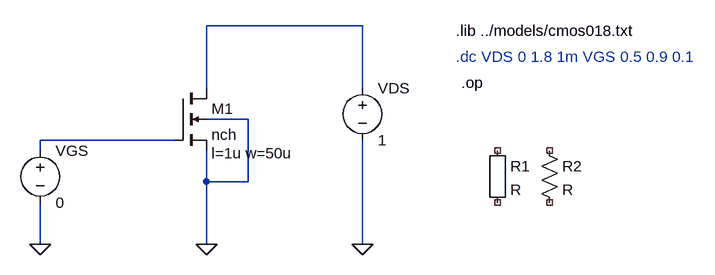
[diagram p0: schematic VAchar.asc]
VAchar.asc, the LTspice schematic file:
Version 4
SHEET 1 912 680
WIRE 384 -16 144 -16
WIRE 144 80 144 -16
WIRE 384 80 384 -16
WIRE 208 128 144 128
WIRE 96 160 -112 160
WIRE -112 176 -112 160
WIRE 144 224 144 176
WIRE 208 224 208 128
WIRE 208 224 144 224
WIRE -112 320 -112 256
WIRE 144 320 144 224
WIRE 384 320 384 160
FLAG 144 320 0
FLAG -112 320 0
FLAG 384 320 0
SYMBOL nmos4 96 80 R0
WINDOW 123 56 100 Left 2
SYMATTR InstName M1
SYMATTR Value nch
SYMATTR Value2 l=1u w=50u
SYMBOL voltage -112 160 R0
WINDOW 123 0 0 Left 0
WINDOW 39 0 0 Left 0
SYMATTR InstName VGS
SYMATTR Value 0
SYMBOL voltage 384 64 R0
SYMATTR InstName VDS
SYMATTR Value 1
SYMBOL Misc\\EuropeanResistor 576 160 R0
SYMATTR InstName R1
SYMBOL res 656 160 R0
SYMATTR InstName R2
TEXT 528 -8 Left 2 !.lib ../models/cmos018.txt
TEXT 528 32 Left 2 ;.dc VDS 0 1.8 1m VGS 0.5 0.9 0.1
TEXT 536 72 Left 2 !.op

The netlist it stands for:
* VAchar.asc
M1 N001 N002 0 0 nch l=1u w=50u
VGS N002 0 0
VDS N001 0 1
R1 NC_01 NC_02 R
R2 NC_03 NC_04 R
.model NMOS NMOS
.model PMOS PMOS
.lib standard.mos
.lib ../models/cmos018.txt
* .dc VDS 0 1.8 1m VGS 0.5 0.9 0.1
.op
.backanno
.end